# Altium project VET6_Coreboard.PrjPcb
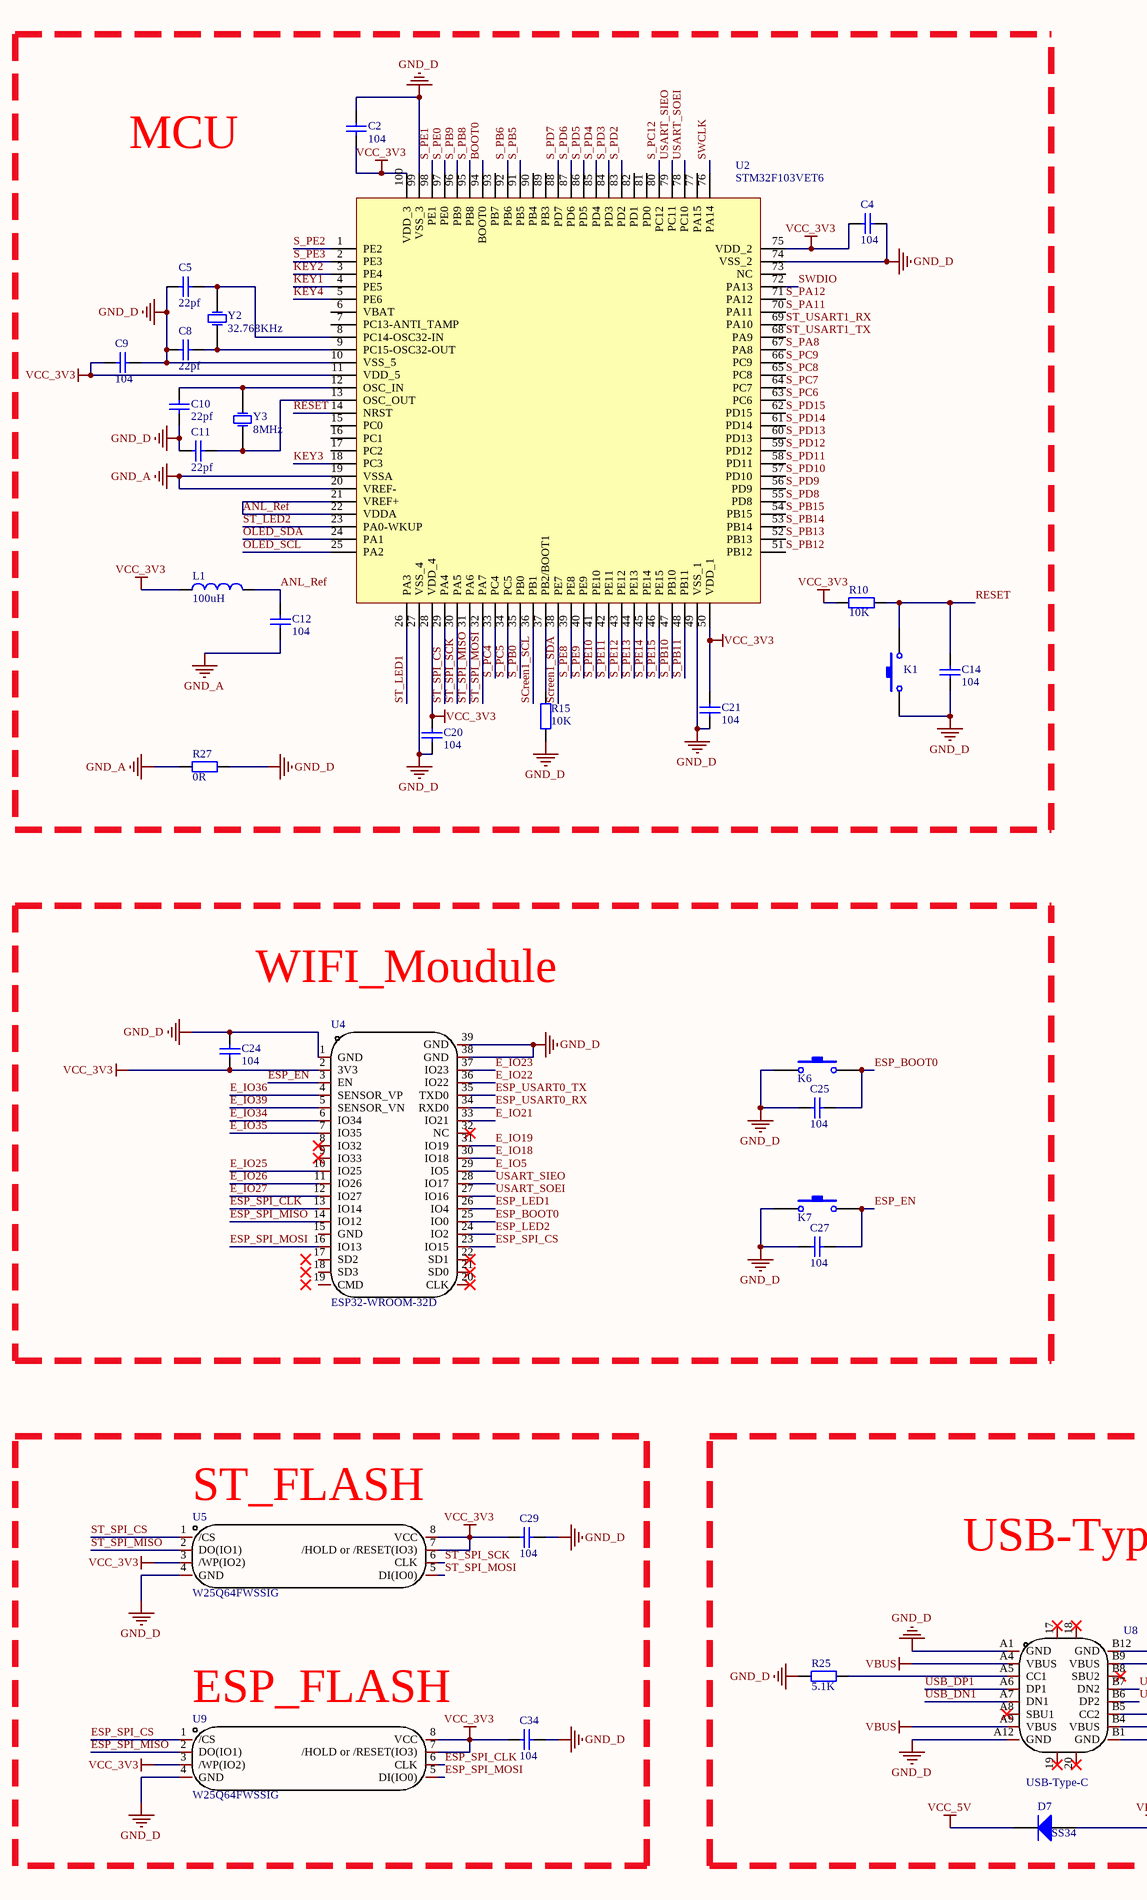
[diagram p0: VET6_Coreboard.SchDoc, left]
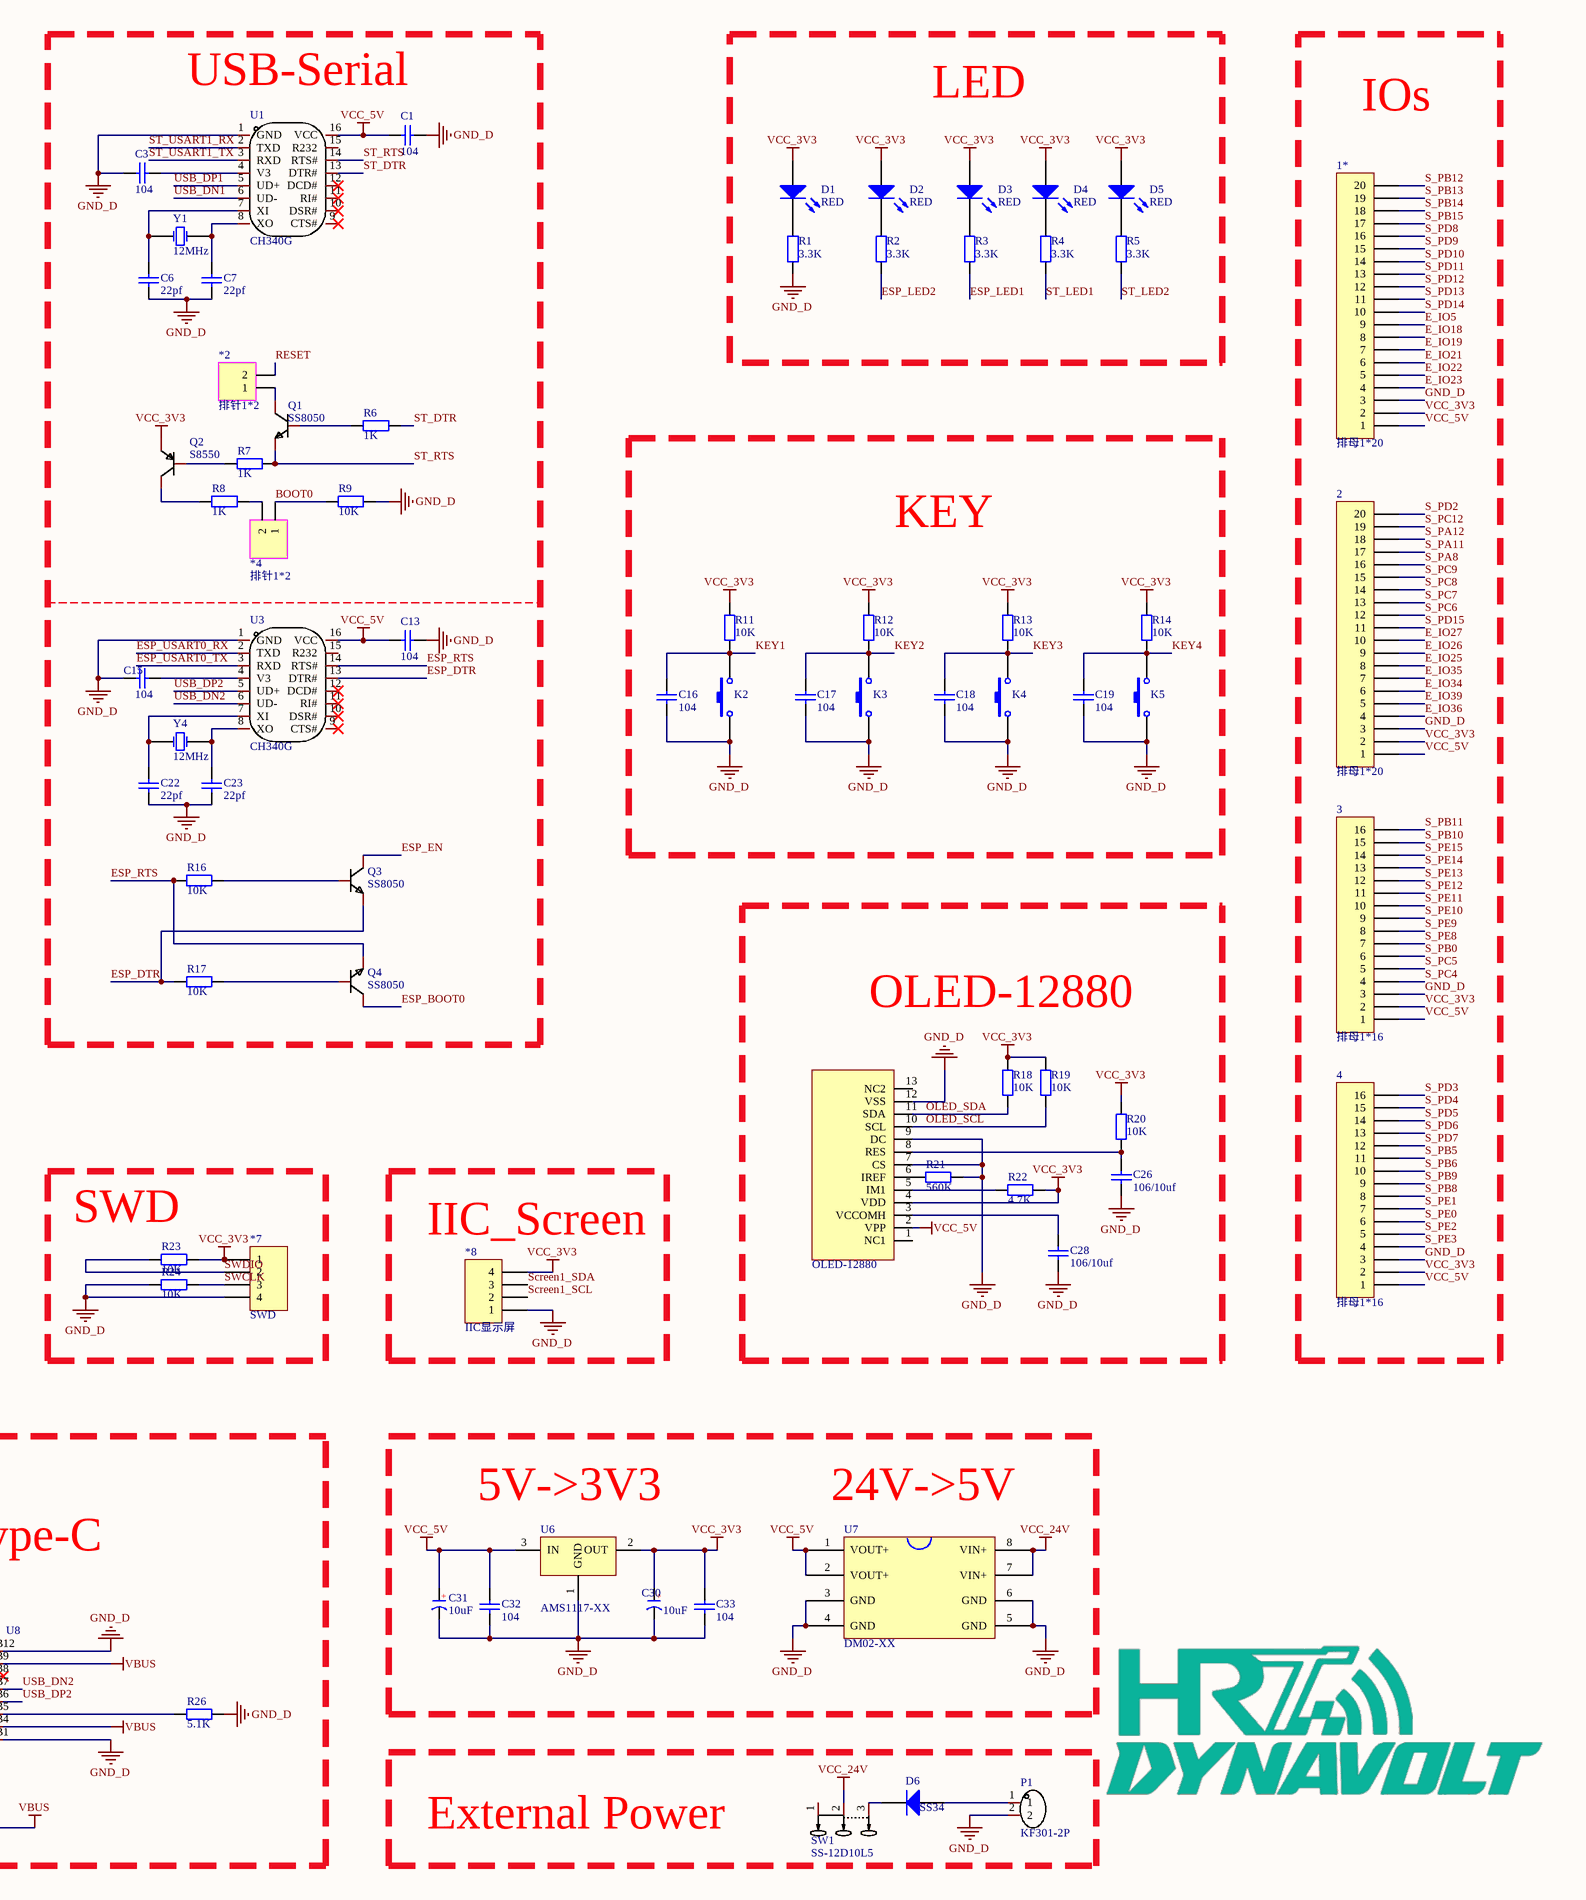
[diagram p1: VET6_Coreboard.SchDoc, right]
1 sheet, 104 parts. Net scope: global (net labels, ports and power ports of the same name join across sheets).
Board file: VET6_Coreboard.PcbDoc

## Sheet VET6_Coreboard.SchDoc: VET6_Coreboard
size A2; CheckedBy: QZTX; Author: QZTX; CompanyName: GW-HRT; DrawnBy: QZTX; Engineer: QZTX; Organization: GW-HRT; Revision: 1.0; SheetNumber: 1; DocumentName: VET6_Coreboard; ProjectName: VET6_Coreboard

### Parts
1  OLED-12880  [OLED-12880]
1*  排母1*20  [HDR2.54-M-LI-20P]
2  排母1*20  [HDR2.54-M-LI-20P]
3  排母1*16  [HDR2.54-M-LI-16P]
4  排母1*16  [HDR2.54-M-LI-16P]
*2  排针1*2  [HDR2.54-LI-2P]
*4  排针1*2  [HDR2.54-LI-2P]
*7  SWD  [HDR2.54-LI-4P]
*8  IIC显示屏  [HDR2.54-M-LI-4P]
C1  104  [C 0805]
C2  104  [C 0805]
C3  104  [C 0805]
C4  104  [C 0805]
C5  22pf  [C 0805]
C6  22pf  [C 0805]
C7  22pf  [C 0805]
C8  22pf  [C 0805]
C9  104  [C 0805]
C10  22pf  [C 0805]
C11  22pf  [C 0805]
C12  104  [C 0805]
C13  104  [C 0805]
C14  104  [C 0805]
C15  104  [C 0805]
C16  104  [C 0805]
C17  104  [C 0805]
C18  104  [C 0805]
C19  104  [C 0805]
C20  104  [C 0805]
C21  104  [C 0805]
C22  22pf  [C 0805]
C23  22pf  [C 0805]
C24  104  [C 0805]
C25  104  [C 0805]
C26  106/10uf  [C 0805]
C27  104  [C 0805]
C28  106/10uf  [C 0805]
C29  104  [C 0805]
C30  10uF  [CD B(3528)]
C31  10uF  [CD B(3528)]
C32  104  [C 0805]
C33  104  [C 0805]
C34  104  [C 0805]
D1  RED  [LED_0805]
D2  RED  [LED_0805]
D3  RED  [LED_0805]
D4  RED  [LED_0805]
D5  RED  [LED_0805]
D6  SS34  [DO-214]
D7  SS34  [DO-214]
K1  Key  [KEY 3.6*2.5 SMD]  (value not drawn)
K2  Key  [KEY 3.6*2.5 SMD]  (value not drawn)
K3  Key  [KEY 3.6*2.5 SMD]  (value not drawn)
K4  Key  [KEY 3.6*2.5 SMD]  (value not drawn)
K5  Key  [KEY 3.6*2.5 SMD]  (value not drawn)
K6  Key  [KEY 3.6*2.5 SMD]  (value not drawn)
K7  Key  [KEY 3.6*2.5 SMD]  (value not drawn)
L1  100uH  [L 0805]
P1  Name: KF301-2P  [CONN-TH_XY301V-A-5.0-2P]  (hidden comment: KF301-2P���߶���)
Q1  SS8050  [SOT-23-3_L2.9-W1.3-P1.90-LS2.4-BR]
Q2  S8550  [SOT-23-3_L2.9-W1.3-P1.90-LS2.4-BR]
Q3  SS8050  [SOT-23-3_L2.9-W1.3-P1.90-LS2.4-BR]
Q4  SS8050  [SOT-23-3_L2.9-W1.3-P1.90-LS2.4-BR]
R1  3.3K  [R 0805]
R2  3.3K  [R 0805]
R3  3.3K  [R 0805]
R4  3.3K  [R 0805]
R5  3.3K  [R 0805]
R6  1K  [R 0805]
R7  1K  [R 0805]
R8  1K  [R 0805]
R9  10K  [R 0805]
R10  10K  [R 0805]
R11  10K  [R 0805]
R12  10K  [R 0805]
R13  10K  [R 0805]
R14  10K  [R 0805]
R15  10K  [R 0805]
R16  10K  [R 0805]
R17  10K  [R 0805]
R18  10K  [R 0805]
R19  10K  [R 0805]
R20  10K  [R 0805]
R21  560K  [R 0805]
R22  4.7K  [R 0805]
R23  10K  [R 0805]
R24  10K  [R 0805]
R25  5.1K  [R 0805]
R26  5.1K  [R 0805]
R27  0R  [R 0805]
SW1  SS-12D10L5  [SW-TH_SS-12D10L5]
U1  CH340G  [SOIC-16_L9.9-W3.9-P1.27-LS6.0-BL]
U2  STM32F103VET6  [TQFP100N50P14X14X1.2]
U3  CH340G  [SOIC-16_L9.9-W3.9-P1.27-LS6.0-BL]
U4  ESP32-WROOM-32D  [WIFIM-SMD_ESP32-WROOM-32D]
U5  W25Q64FWSSIG  [SOIC-8_L5.3-W5.3-P1.27-LS8.0-BL]
U6  AMS1117-XX  [SOT223]
U7  DM02-XX  [DM02]
U8  Name: USB-Type-C  [USB-SMD_TYPE-C16PIN]  (hidden comment: TYPE-C16PIN母座 板上四脚三次molding)
U9  W25Q64FWSSIG  [SOIC-8_L5.3-W5.3-P1.27-LS8.0-BL]
Y1  12MHz  [XTAL-5032]
Y2  32.768KHz  [XTAL-5032]
Y3  8MHz  [XTAL-5032]
Y4  12MHz  [XTAL-5032]

### Blocks framed on the sheet
MCU: C2 C4 C5 C8-C12 C14 C20 C21 K1 L1 R10 R15 R27 U2 Y2 Y3
USB-Serial: *2 *4 C1 C3 C6 C7 C13 C15 C22 C23 Q1-Q4 R6-R9 R16 R17 U1 U3 Y1 Y4
IOs: 1* 2-4
KEY: C16-C19 K2-K5 R11-R14
WIFI_Moudule: C24 C25 C27 K6 K7 U4
OLED-12880: 1 C26 C28 R18-R22
SWD: *7 R23 R24
IIC_Screen: *8
USB-Type-C: D7 R25 R26 U8
External Power: D6 P1 SW1

### Nets
GND_A: C12.2 R27.2 U2.19(VSSA) U2.20(VREF-)
GND_D: 1.7(CS) 1.9(DC) 1.12(VSS) 1*.3 2.3 3.3 4.3 *7.4 *8.1 C1.2 C2.2 C3.1 C4.1 C5.2 C6.2 C7.2 C8.2 C9.1 C10.1 C11.2 C13.2 C14.2 C15.1 C16.1 C17.1 C18.1 C19.1 C20.2 C21.2 C22.2 C23.2 C24.2 C25.2 C26.1 C27.2 C28.1 C29.1 C30.2(K) C31.2(K) C32.1 C33.1 C34.1 K1.1 K2.1 K3.1 K4.1 K5.1 K6.1 K7.1 P1.2 R1.1 R9.1 R15.1 R21.1 R24.1 R25.2 R26.2 R27.1 U1.1(GND) U2.10(VSS_5) U2.27(VSS_4) U2.49(VSS_1) U2.74(VSS_2) U2.99(VSS_3) U3.1(GND) U4.1(GND) U4.38(GND) U4.39(GND) U5.4(GND) U6.1(GND) U7.3(GND) U7.4(GND) U7.5(GND) U7.6(GND) U8.A1(GND) U8.A12(GND) U8.B1(GND) U8.B12(GND) U9.4(GND)
VBUS: D7.1(A) U8.A4(VBUS) U8.A9(VBUS) U8.B4(VBUS) U8.B9(VBUS)
VCC_3V3: 1.4(VDD) 1*.2 2.2 3.2 4.2 *7.1 *8.4 C2.1 C4.2 C9.2 C20.1 C21.1 C24.1 C29.2 C30.1(A) C33.2 C34.2 D1.1(A) D2.1(A) D3.1(A) D4.1(A) D5.1(A) L1.1 Q2.2 R10.1 R11.2 R12.2 R13.2 R14.2 R18.2 R19.2 R20.2 R22.1 R23.2 U2.11(VDD_5) U2.28(VDD_4) U2.50(VDD_1) U2.75(VDD_2) U2.100(VDD_3) U4.2(3V3) U5.3(/WP(IO2)) U5.7(/HOLD_or_/RESET(IO3)) U5.8(VCC) U6.2(OUT) U9.3(/WP(IO2)) U9.7(/HOLD_or_/RESET(IO3)) U9.8(VCC)
VCC_5V: 1.2(VPP) 1*.1 2.1 3.1 4.1 C1.1 C13.1 C31.1(A) C32.2 D7.2(K) U1.16(VCC) U3.16(VCC) U6.3(IN) U7.1(VOUT+) U7.2(VOUT+)
VCC_24V: SW1.2 U7.7(VIN+) U7.8(VIN+)
ANL_Ref: C12.1 L1.2 U2.21(VREF+) U2.22(VDDA)
BOOT0: *4.1 R9.2 U2.94(BOOT0)
E_IO5: 1*.9 U4.29(IO5)
E_IO18: 1*.8 U4.30(IO18)
E_IO19: 1*.7 U4.31(IO19)
E_IO21: 1*.6 U4.33(IO21)
E_IO22: 1*.5 U4.36(IO22)
E_IO23: 1*.4 U4.37(IO23)
E_IO25: 2.8 U4.10(IO25)
E_IO26: 2.9 U4.11(IO26)
E_IO27: 2.10 U4.12(IO27)
E_IO34: 2.6 U4.6(IO34)
E_IO35: 2.7 U4.7(IO35)
E_IO36: 2.4 U4.4(SENSOR_VP)
E_IO39: 2.5 U4.5(SENSOR_VN)
ESP_BOOT0: C25.1 K6.2 Q4.3(C) U4.25(IO0)
ESP_DTR: Q3.2(E) R17.1 U3.13(DTR#)
ESP_EN: C27.1 K7.2 Q3.3(C) U4.3(EN)
ESP_LED1: R3.1 U4.26(IO4)
ESP_LED2: R2.1 U4.24(IO2)
ESP_RTS: Q4.2(E) R16.1 U3.14(RTS#)
ESP_SPI_CLK: U4.13(IO14) U9.6(CLK)
ESP_SPI_CS: U4.23(IO15) U9.1(/CS)
ESP_SPI_MISO: U4.14(IO12) U9.2(DO(IO1))
ESP_SPI_MOSI: U4.16(IO13) U9.5(DI(IO0))
ESP_USART0_RX: U3.2(TXD) U4.34(RXD0)
ESP_USART0_TX: U3.3(RXD) U4.35(TXD0)
KEY1: C16.2 K2.2 R11.1 U2.4(PE5)
KEY2: C17.2 K3.2 R12.1 U2.3(PE4)
KEY3: C18.2 K4.2 R13.1 U2.18(PC3)
KEY4: C19.2 K5.2 R14.1 U2.5(PE6)
OLED_SCL: 1.10(SCL) R19.1 U2.25(PA2)
OLED_SDA: 1.11(SDA) R18.1 U2.24(PA1)
RESET: *2.2 C14.1 K1.2 R10.2 U2.14(NRST)
S_PA8: 2.16 U2.67(PA8)
S_PA11: 2.17 U2.70(PA11)
S_PA12: 2.18 U2.71(PA12)
S_PB0: 3.6 U2.35(PB0)
S_PB5: 4.11 U2.91(PB5)
S_PB6: 4.10 U2.92(PB6)
S_PB8: 4.8 U2.95(PB8)
S_PB9: 4.9 U2.96(PB9)
S_PB10: 3.15 U2.47(PB10)
S_PB11: 3.16 U2.48(PB11)
S_PB12: 1*.20 U2.51(PB12)
S_PB13: 1*.19 U2.52(PB13)
S_PB14: 1*.18 U2.53(PB14)
S_PB15: 1*.17 U2.54(PB15)
S_PC4: 3.4 U2.33(PC4)
S_PC5: 3.5 U2.34(PC5)
S_PC6: 2.12 U2.63(PC6)
S_PC7: 2.13 U2.64(PC7)
S_PC8: 2.14 U2.65(PC8)
S_PC9: 2.15 U2.66(PC9)
S_PC12: 2.19 U2.80(PC12)
S_PD2: 2.20 U2.83(PD2)
S_PD3: 4.16 U2.84(PD3)
S_PD4: 4.15 U2.85(PD4)
S_PD5: 4.14 U2.86(PD5)
S_PD6: 4.13 U2.87(PD6)
S_PD7: 4.12 U2.88(PD7)
S_PD8: 1*.16 U2.55(PD8)
S_PD9: 1*.15 U2.56(PD9)
S_PD10: 1*.14 U2.57(PD10)
S_PD11: 1*.13 U2.58(PD11)
S_PD12: 1*.12 U2.59(PD12)
S_PD13: 1*.11 U2.60(PD13)
S_PD14: 1*.10 U2.61(PD14)
S_PD15: 2.11 U2.62(PD15)
S_PE0: 4.6 U2.97(PE0)
S_PE1: 4.7 U2.98(PE1)
S_PE2: 4.5 U2.1(PE2)
S_PE3: 4.4 U2.2(PE3)
S_PE8: 3.7 U2.39(PE8)
S_PE9: 3.8 U2.40(PE9)
S_PE10: 3.9 U2.41(PE10)
S_PE11: 3.10 U2.42(PE11)
S_PE12: 3.11 U2.43(PE12)
S_PE13: 3.12 U2.44(PE13)
S_PE14: 3.13 U2.45(PE14)
S_PE15: 3.14 U2.46(PE15)
Screen1_SCL: *8.2 U2.36(PB1)
Screen1_SDA: *8.3 U2.38(PE7)
ST_DTR: R6.1 U1.13(DTR#)
ST_LED1: R4.1 U2.26(PA3)
ST_LED2: R5.1 U2.23(PA0-WKUP)
ST_RTS: Q1.2(E) R7.1 U1.14(RTS#)
ST_SPI_CS: U2.29(PA4) U5.1(/CS)
ST_SPI_MISO: U2.31(PA6) U5.2(DO(IO1))
ST_SPI_MOSI: U2.32(PA7) U5.5(DI(IO0))
ST_SPI_SCK: U2.30(PA5) U5.6(CLK)
ST_USART1_RX: U1.2(TXD) U2.69(PA10)
ST_USART1_TX: U1.3(RXD) U2.68(PA9)
SWCLK: *7.3 R24.2 U2.76(PA14)
SWDIO: *7.2 R23.1 U2.72(PA13)
USART_SIEO: U2.79(PC11) U4.28(IO17)
USART_SOEI: U2.78(PC10) U4.27(IO16)
USB_DN1: U1.6(UD-) U8.A7(DN1)
USB_DN2: U3.6(UD-) U8.B7(DN2)
USB_DP1: U1.5(UD+) U8.A6(DP1)
USB_DP2: U3.5(UD+) U8.B6(DP2)
Net1_3: 1.3(VCCOMH) C28.2
Net1_5: 1.5(IM1) R22.2
Net1_6: 1.6(IREF) R21.2
Net1_8: 1.8(RES) C26.2 R20.1
Net*2_1: *2.1 Q1.3(C)
Net*4_2: *4.2 R8.1
NetC3_2: C3.2 U1.4(V3)
NetC5_1: C5.1 U2.8(PC14-OSC32-IN) Y2.2(OSC2)
NetC6_1: C6.1 U1.7(XI) Y1.2(OSC2)
NetC7_1: C7.1 U1.8(XO) Y1.1(OSC1)
NetC8_1: C8.1 U2.9(PC15-OSC32-OUT) Y2.1(OSC1)
NetC10_2: C10.2 U2.12(OSC_IN) Y3.2(OSC2)
NetC11_1: C11.1 U2.13(OSC_OUT) Y3.1(OSC1)
NetC15_2: C15.2 U3.4(V3)
NetC22_1: C22.1 U3.7(XI) Y4.2(OSC2)
NetC23_1: C23.1 U3.8(XO) Y4.1(OSC1)
NetD1_2: D1.2(K) R1.2
NetD2_2: D2.2(K) R2.2
NetD3_2: D3.2(K) R3.2
NetD4_2: D4.2(K) R4.2
NetD5_2: D5.2(K) R5.2
NetD6_1: D6.1(A) P1.1
NetD6_2: D6.2(K) SW1.3
NetQ1_1: Q1.1(B) R6.2
NetQ2_1: Q2.1 R7.2
NetQ2_3: Q2.3 R8.2
NetQ3_1: Q3.1(B) R16.2
NetQ4_1: Q4.1(B) R17.2
NetR15_2: R15.2 U2.37(PB2/BOOT1)
NetR25_1: R25.1 U8.A5(CC1)
NetR26_1: R26.1 U8.B5(CC2)

Not connected (* = marked no-connect by the designer): 1 1(NC1) 13(NC2); SW1 1; U1 9(CTS#)* 10(DSR#)* 11(RI#)* 12(DCD#)* 15(R232); U2 6(VBAT) 7(PC13-ANTI_TAMP) 15(PC0) 16(PC1) 17(PC2) 73(NC) 77(PA15) 81(PD0) 82(PD1) 89(PB3) 90(PB4) 93(PB7); U3 9(CTS#)* 10(DSR#)* 11(RI#)* 12(DCD#)* 15(R232); U4 8(IO32)* 9(IO33)* 15(GND) 17(SD2) 18(SD3) 19(CMD) 20(CLK)* 21(SD0)* 22(SD1)* 32(NC)*; U8 17* 18* 19* 20* A8(SBU1)* B8(SBU2)*

### Notes on the sheet
- LED
- (near U5) ST_FLASH
- (near U6) 5V->3V3
- (near U7) 24V->5V
- (near U9) ESP_FLASH
- (in symbol 贴片钽电容) +

### Library data of the parts
*7 = 排针1*4
*8 = 排母1*4
C1-C29 C32-C34 = Cap: 无极性电容
C30 C31 = 贴片钽电容
D1-D5 = LED: 发光二极管
D6 D7 = Diode: 二极管
K1-K7 = Key: 按键
L1 = Inductor: 电感
P1 = KF301-2P接线端子: Add into BOM: yes; Symbol: KF301-2P���߶���; Device: KF301-2P���߶���; LCSC Part Name: KF301-2P���߶���; Supplier Part: C9900016950; Manufacturer Part: KF301-2P���߶���; Supplier Footprint: CK301-2P; JLCPCB Part Class: ��չ��; Datasheet: https://atta.szlcsc.comnull; Supplier: LCSC; Convert to PCB: yes
Q1 Q3 Q4 = SS8050_C2150: Manufacturer: CJ(���ճ���/����); Add into BOM: yes; Transistor Type: NPN; Collector Current (Ic): 1.5A; Collector-Emitter Breakdown Voltage (Vceo): 25V; Power Dissipation (Pd): 300mW; DC Current Gain (hFE@Ic,Vce): 200@100mA,1V; Transition Frequency (fT): 100MHz; Collector Cut-Off Current (Icbo): 100nA; Collector-Emitter Saturation Voltage (VCE(sat)@Ic,Ib): 500mV@800mA,80mA; Symbol: SS8050_C2150; Device: SS8050_C2150; Supplier: LCSC; Manufacturer Part: SS8050; Supplier Part: C2150; JLCPCB Part Class: ������; LCSC Part Name: NPN ����:1.5A ��ѹ:25V hfe=200~350; Supplier Footprint: SOT-23; Datasheet: https://atta.szlcsc.com/upload/public/pdf/source/20230322/AEE86F4B043774EFF80CAEA14A37D9E9.pdf; Convert to PCB: yes; Operating Temperature: -; Name: SS8050
Q2 = S8550_C105432: Manufacturer: CJ(���ճ���/����); Add into BOM: yes; Transistor Type: PNP; Collector Current (Ic): 500mA; Collector-Emitter Breakdown Voltage (Vceo): 25V; Power Dissipation (Pd): 300mW; DC Current Gain (hFE@Ic,Vce): 120@50mA,1V; Transition Frequency (fT): 150MHz; Collector Cut-Off Current (Icbo): 100nA; Collector-Emitter Saturation Voltage (VCE(sat)@Ic,Ib): 600mV@500mA,50mA; Symbol: S8550_C105432; Device: S8550_C105432; Supplier: LCSC; Manufacturer Part: S8550; Supplier Part: C105432; JLCPCB Part Class: ������; LCSC Part Name: PNP ����:500mA ��ѹ:25V L��120-200; Supplier Footprint: SOT-23; Datasheet: https://atta.szlcsc.com/upload/public/pdf/source/20171228/C164891_15144412930301213894.pdf; Convert to PCB: yes; Operating Temperature: -; Name: S8550
R1-R27 = Resistor: 电阻
SW1 = SS-12D10L5: Manufacturer: XKB Connectivity(�й�����); Add into BOM: yes; Circuit: ����˫��; Actuator Style: ������״; Pin Style: PC����; Switch Length: 13mm; Switch Width: 6.8mm; Switch Height: 6.4mm; Actuator Color: ��ɫ; Current Rating (DC): 3A; Voltage Rating (DC): 125V; Mechanical Life: 1���; Symbol: SS-12D10L5; Device: SS-12D10L5; Supplier: LCSC; Supplier Part: C319012; Manufacturer Part: SS-12D10L5; JLCPCB Part Class: ��չ��; LCSC Part Name: ����5mm ֱ��˫�� ��������; Supplier Footprint: ���; Datasheet: https://atta.szlcsc.com/upload/public/pdf/source/20211009/D6412F37AABE6F9459A6EE7FA4DAEADB.pdf; Convert to PCB: yes; Mounting Style: ֱ��; Current Rating (AC): 3A; Voltage Rating (AC): 125V; Operating Temperature: -40��~+85��; Name: SS-12D10L5
U1 U3 = CH340G: 应用功能:收发器;接口协议:USB 2.0;数据速率:2Mbps;; Manufacturer: WCH(南京沁恒); Add into BOM: yes; Applications Function: 收发器; Protocol: USB 2.0; Data Rate: 2Mbps; Supply Voltage: 3.3V；5V; Symbol: CH340G; Device: CH340G; LCSC Part Name: USB转串口芯片 CH340; Supplier Part: C14267; Manufacturer Part: CH340G; Supplier Footprint: SOP-16; JLCPCB Part Class: 扩展库; Datasheet: https://atta.szlcsc.com/upload/public/pdf/source/20230530/6E401E9554E9F5311886CC8B3F89B62E.pdf; Supplier: LCSC; Convert to PCB: yes; Name: CH340G
U2 = STM32F103RBT6: Published: 20110607
U4 = ESP32-WROOM-32D: Symbol: ESP32-WROOM-32D_C503588; Add into BOM: yes; Device: ESP32-WROOM-32D; LCSC Part Name: ESP32-WROOM-32D; Supplier Part: C503588; Manufacturer Part: ESP32-WROOM-32D; Supplier Footprint: Module; Datasheet: https://atta.szlcsc.com/upload/public/pdf/source/20200407/C503588_9E920733859C3E86D4243CAB277EC877.pdf; Supplier: LCSC; Convert to PCB: yes; Name: ESP32-WROOM-32D
U5 U9 = W25Q64FWSSIG: Manufacturer: WINBOND(华邦); Add into BOM: yes; Symbol: W25Q64FWSSIG; Device: W25Q64FWSSIG; LCSC Part Name: W25Q64FWSSIG 停产; Supplier Part: C255341; Manufacturer Part: W25Q64FWSSIG; Supplier Footprint: SOIC-8-208mil; JLCPCB Part Class: 扩展库; Datasheet: https://atta.szlcsc.com/upload/public/pdf/source/20180725/C255341_81A36CB662A838CC98585C5516D19112.pdf; Supplier: LCSC; Convert to PCB: yes; Name: W25Q64FWSSIG
U6 = AMS1117: 线性稳压器
U7 = DM02: 开关型DC-DC变换器
U8 = TYPE-C16PIN母座 板上四脚三次molding: Add into BOM: yes; Symbol: TYPE-C16PIN母座 板上四脚三次MOLDING; Device: TYPE-C16PIN母座 板上四脚三次molding; LCSC Part Name: TYPE-C16PIN母座 板上四脚三次molding; Supplier Part: C9900000202; Manufacturer Part: TYPE-C16PIN母座 板上四脚三次molding; Supplier Footprint: TYPE-C16PIN; JLCPCB Part Class: 扩展库; Datasheet: 2021-09-15/03900G/aaf837f0873f462e9eab7ac60a9bb940/aac77-74p5r.pdf; Supplier: LCSC; Convert to PCB: yes
Y1-Y4 = XTAL: 晶振